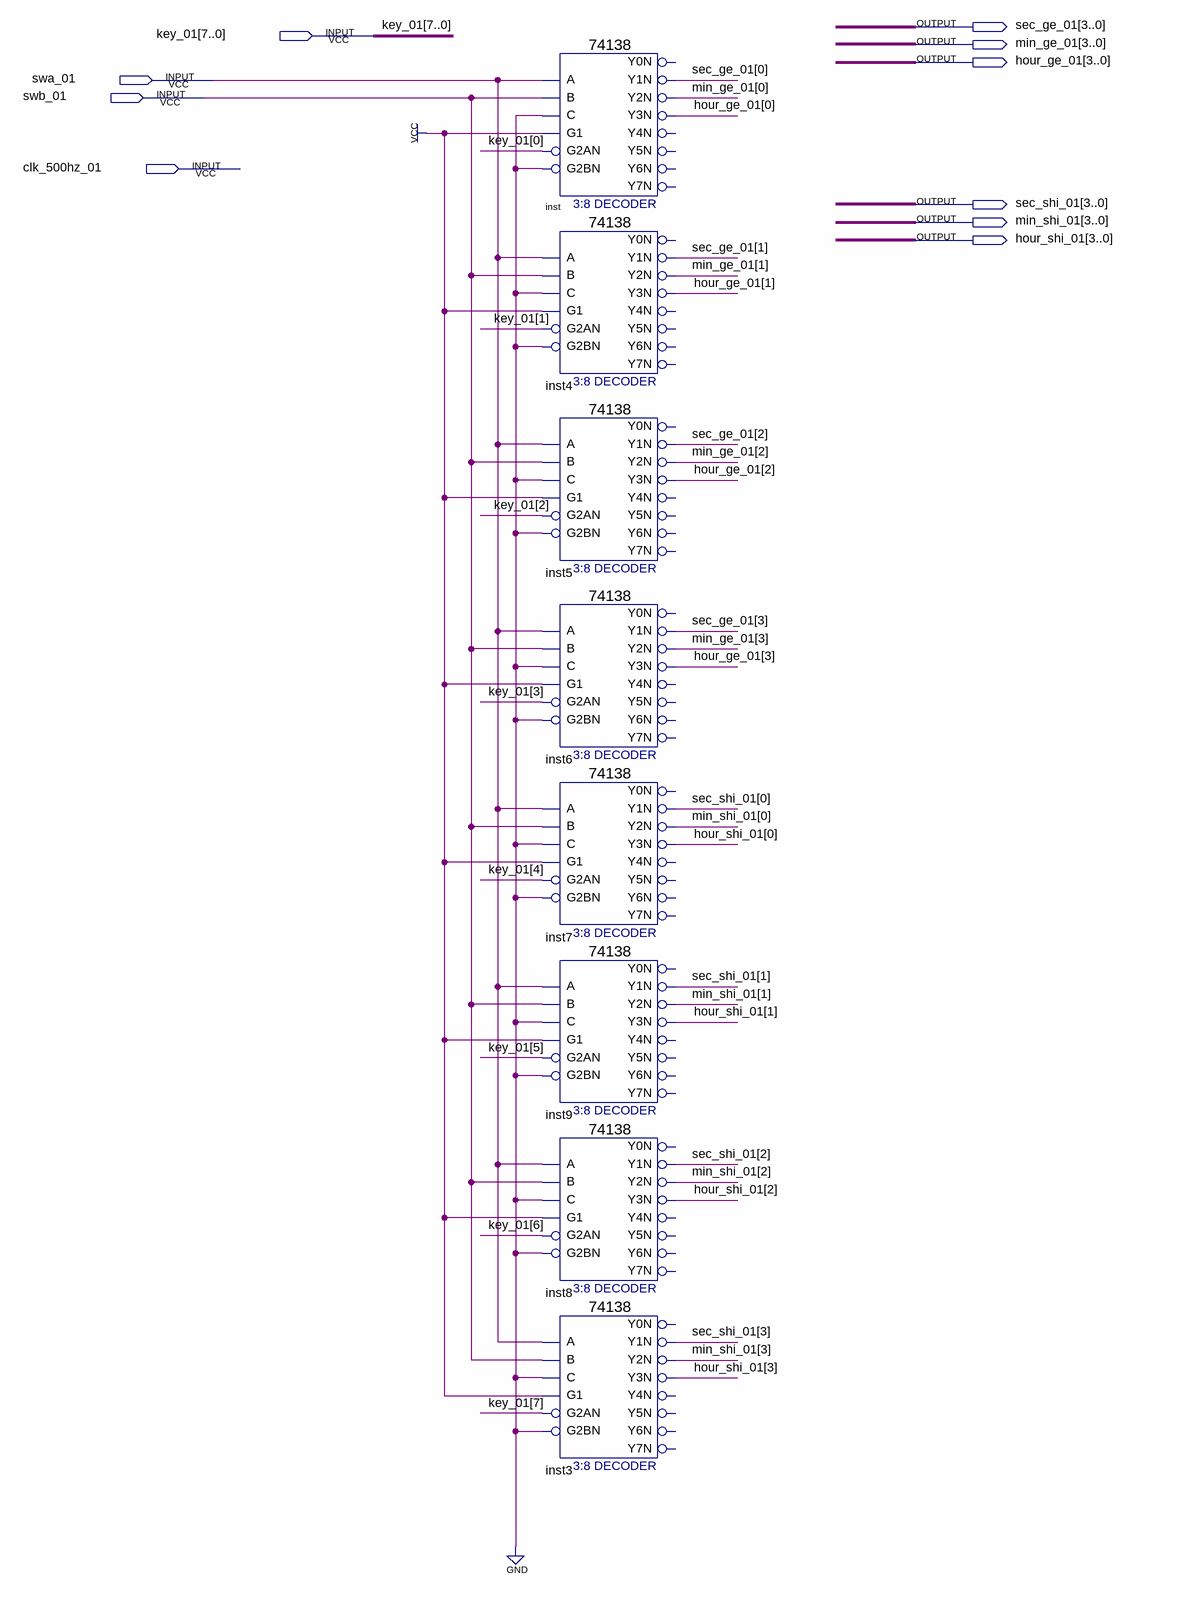
[diagram p0: schematic sheet]
// Quartus schematic fre_cin.bdf as structural Verilog: 8 symbols, 10 pins
module fre_cin (
  input  [7:0] key_01,
  input  swa_01,
  input  swb_01,
  input  clk_500hz_01,
  output [3:0] sec_ge_01,
  output [3:0] min_ge_01,
  output [3:0] hour_ge_01,
  output [3:0] sec_shi_01,
  output [3:0] min_shi_01,
  output [3:0] hour_shi_01
);

  \74138  inst (
    .A(swa_01), .B(swb_01), .G1(1'b1), .C(1'b0), .G2AN(key_01[0]), .G2BN(1'b0), .Y1N(sec_ge_01[0]),
    .Y2N(min_ge_01[0]), .Y3N(hour_ge_01[0]));  // open: Y0N, Y4N, Y5N, Y6N, Y7N
  \74138  inst4 (
    .A(swa_01), .B(swb_01), .G1(1'b1), .C(1'b0), .G2AN(key_01[1]), .G2BN(1'b0), .Y1N(sec_ge_01[1]),
    .Y2N(min_ge_01[1]), .Y3N(hour_ge_01[1]));  // open: Y0N, Y4N, Y5N, Y6N, Y7N
  \74138  inst5 (
    .A(swa_01), .B(swb_01), .G1(1'b1), .C(1'b0), .G2AN(key_01[2]), .G2BN(1'b0), .Y1N(sec_ge_01[2]),
    .Y2N(min_ge_01[2]), .Y3N(hour_ge_01[2]));  // open: Y0N, Y4N, Y5N, Y6N, Y7N
  \74138  inst6 (
    .A(swa_01), .B(swb_01), .G1(1'b1), .C(1'b0), .G2AN(key_01[3]), .G2BN(1'b0), .Y1N(sec_ge_01[3]),
    .Y2N(min_ge_01[3]), .Y3N(hour_ge_01[3]));  // open: Y0N, Y4N, Y5N, Y6N, Y7N
  \74138  inst7 (
    .A(swa_01), .B(swb_01), .G1(1'b1), .C(1'b0), .G2AN(key_01[4]), .G2BN(1'b0), .Y1N(sec_shi_01[0]),
    .Y2N(min_shi_01[0]), .Y3N(hour_shi_01[0]));  // open: Y0N, Y4N, Y5N, Y6N, Y7N
  \74138  inst9 (
    .A(swa_01), .B(swb_01), .G1(1'b1), .C(1'b0), .G2AN(key_01[5]), .G2BN(1'b0), .Y1N(sec_shi_01[1]),
    .Y2N(min_shi_01[1]), .Y3N(hour_shi_01[1]));  // open: Y0N, Y4N, Y5N, Y6N, Y7N
  \74138  inst8 (
    .A(swa_01), .B(swb_01), .G1(1'b1), .C(1'b0), .G2AN(key_01[6]), .G2BN(1'b0), .Y1N(sec_shi_01[2]),
    .Y2N(min_shi_01[2]), .Y3N(hour_shi_01[2]));  // open: Y0N, Y4N, Y5N, Y6N, Y7N
  \74138  inst3 (
    .A(swa_01), .B(swb_01), .G1(1'b1), .C(1'b0), .G2AN(key_01[7]), .G2BN(1'b0), .Y1N(sec_shi_01[3]),
    .Y2N(min_shi_01[3]), .Y3N(hour_shi_01[3]));  // open: Y0N, Y4N, Y5N, Y6N, Y7N
endmodule
